# EAGLE design esp-rfid-relay-board (EAGLE 7.7.0)
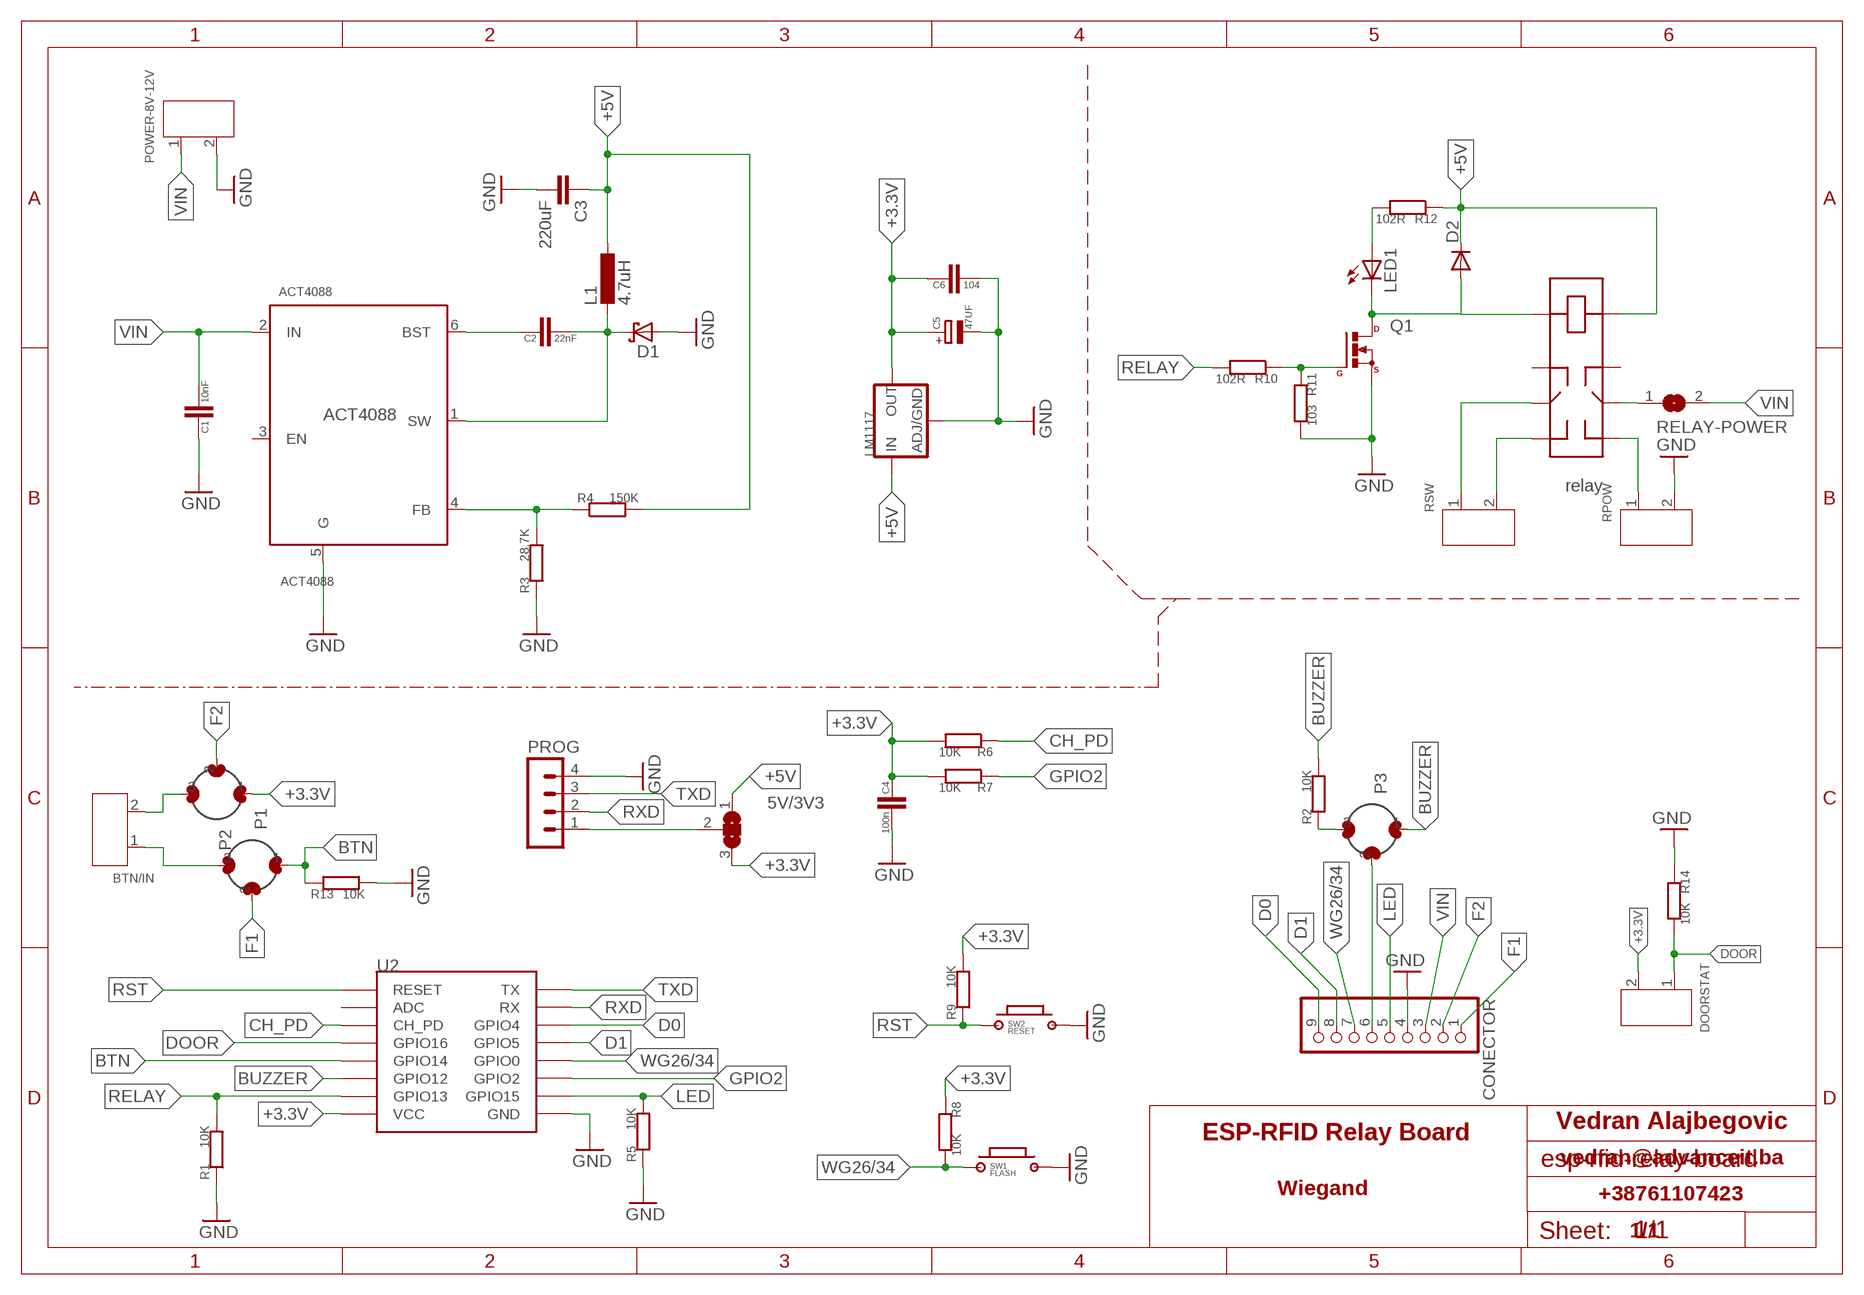
[diagram p0: schematic, sheet 1]

## Parts
5V/3V3  SJ2W  [SJ_2]
ACT4088  ACT4088  ACT4088-(SOT23-6)  [SOT-23-6]
BTN/IN  SCREW-TERMINAL-GREEN(2P-3.5)  [H2-3.5-7.0X7.0MM]
C1  10nF  CAPC0805  [C_0805]
C2  22nF  CAPC0805  [C_0805]
C3  220uF  C-EUC1210  [C1210]
C4  100n  CAPC0805  [C_0805]
C5  47UF  CPOLB_3528  [CPOL_B3528]
C6  104  CAPC0805  [C_0805]
CONECTOR  PINHD-1X9  [1X09]
D1  SCHOTTKY-DIODESMD  [SMB]
D2  4007-4148  DIODESOD123FL  [DIO_SOD123FL]
DOORSTAT  SCREW-TERMINAL-GREEN(2P-3.5)  [H2-3.5-7.0X7.0MM]
L1  4.7uH  L-EUL3225M  [L3225M]
LED1  LED0805LED  [0805LED]
LM1117  POWERSOT223  [SOT223]
P1  SJ3  [SJ_3]
P2  SJ3  [SJ_3]
P3  SJ3  [SJ_3]
POWER-8V-12V  SCREW-TERMINAL-GREEN(2P-3.5)  [H2-3.5-7.0X7.0MM]
PROG  MA04-1  [MA04-1]
Q1  MOSFET_NSOT23  [SOT23]
R1  10K  RESISTORR0805  [R_0805]
R2  10K  RESISTORR0805  [R_0805]
R3  28.7K  RESISTORR0805  [R_0805]
R4  150K  RESISTORR0805  [R_0805]
R5  10K  RESISTORR0805  [R_0805]
R6  10K  RESISTORR0805  [R_0805]
R7  10K  RESISTORR0805  [R_0805]
R8  10K  RESISTORR0805  [R_0805]
R9  10K  RESISTORR0805  [R_0805]
R10  102R  RESISTORR0805  [R_0805]
R11  103  RESISTORR0805  [R_0805]
R12  102R  RESISTORR0805  [R_0805]
R13  10K  RESISTORR0805  [R_0805]
R14  10K  RESISTORR0805  [R_0805]
RELAY  2XSWITCH  [HFD3-SIGNAL]
RELAY-POWER  SJ  [SJ]
RPOW  SCREW-TERMINAL-GREEN(2P-3.5)  [H2-3.5-7.0X7.0MM]
RSW  SCREW-TERMINAL-GREEN(2P-3.5)  [H2-3.5-7.0X7.0MM]
SW1  FLASH  BUTTON-2PSWITCH-TURTLE-2P  [2P-SWITCH-TURTLE]
SW2  RESET  BUTTON-2PSWITCH-TURTLE-2P  [2P-SWITCH-TURTLE]
U2  ESP12SMD  [ESP12-SMD]

## Nets
+3.3V: 5V/3V3.3 C4.1 C5.+ C6.1 DOORSTAT.2 LM1117.OUT1(OUT) LM1117.OUT2(OUT) P2.1 R6.2 R7.2 R8.1 R9.2 U2.VCC
+5V [VCC]: 5V/3V3.1 C3.1 D2.C L1.1 LM1117.IN+(IN) R4.2 R12.1 RELAY.8
BTN: P1.1 R13.1 U2.GPIO14
BUCK1: ACT4088.1(SW) C2.2 D1.C L1.2
BUCK2: ACT4088.4(FB) R3.2 R4.1
BUCK3: ACT4088.6(BST) C2.1
BUZZER: P3.1 R2.2 U2.GPIO12
CH_PD: R6.1 U2.CH_PD
D0: CONECTOR.9 U2.GPIO4
D1: CONECTOR.8 U2.GPIO5
DOOR: DOORSTAT.1 R14.2 U2.GPIO16
F1: CONECTOR.1 P1.2
F2: CONECTOR.2 P2.2
GND: ACT4088.5(G) C1.1 C3.2 C4.2 C5.- C6.2 CONECTOR.4 D1.A LM1117.GND POWER-8V-12V.2 PROG.4 Q1.2(S) R1.1 R3.1 R5.1 R11.2 R13.2 R14.1 RPOW.2 SW1.2 SW2.2 U2.GND
GPIO2: R7.1 U2.GPIO2
LED: CONECTOR.5 R5.2 U2.GPIO15
N$2: 5V/3V3.2 PROG.1
N$3: RELAY-POWER.1 RELAY.6
N$4: RELAY.5 RPOW.1
N$5: RELAY.4 RSW.2
N$6: BTN/IN.1 P1.3
N$7: BTN/IN.2 P2.3
N$8: RELAY.3 RSW.1
N$9: CONECTOR.6 P3.2
N$10: P3.3 R2.1
RELAY: R1.2 R10.2 U2.GPIO13
RELN1: Q1.1(G) R10.1 R11.1
RELN2 [ANT]: D2.A LED1.C Q1.3(D) RELAY.1
RELN4: LED1.A R12.2
RST: R9.1 SW2.1 U2.RESET
RXD: PROG.2 U2.RXD0(RX)
TXD: PROG.3 U2.TXD0(TX)
VIN: ACT4088.2(IN) C1.2 CONECTOR.3 POWER-8V-12V.1 RELAY-POWER.2
WG26/34: CONECTOR.7 R8.2 SW1.1 U2.GPIO0
Unconnected: ACT4088.3(EN) RELAY.2 RELAY.7 U2.ADC

## Notes on the sheet
- relay
- Vedran Alajbegovic
- ESP-RFID Relay Board
- vedran@advanceit.ba
- Wiegand | +38761107423
- 1/1

## Library data of the parts
5V/3V3 = jumper:SJ2W: SMD solder JUMPER
ACT4088 = Seeed-IC-2016:ACT4088-(SOT23-6): 310030104; MPN: AIC1896CG; VALUE: AIC1896CG-SOT23-6
BTN/IN DOORSTAT POWER-8V-12V RPOW RSW = Seeed-Connector -2016:SCREW-TERMINAL-GREEN(2P-3.5): 320110028; VALUE: GREEN-2P-3.5
C1 C2 C4 C6 = PRT-RCL:CAP
C3 = resistor:C-EU: CAPACITOR, European symbol
C5 = PRT-RCL:CPOL
CONECTOR = pinhead:PINHD-1X9: PIN HEADER
D1 = diode:SCHOTTKY-DIODE: Schottky Diode
D2 = PRT-RCL:DIODE: 1N4148;
L1 = rcl:L-EU: INDUCTOR, European symbol
LED1 = PRT-LEDs:LED
LM1117 = IC-Power:POWER: Voltage Regulator LM1117 Standard adjustable voltage regulator but in SMD form. Spark Fun Electronics SKU : COM-00595
P1-P3 = jumper:SJ3: SMD solder JUMPER
PROG = con-lstb:MA04-1: PIN HEADER; OC_FARNELL: unknown; OC_NEWARK: unknown
Q1 = PRT-RCL:MOSFET_N: Power MOSFET N-Channel
R1-R14 = PRT-RCL:RESISTOR
RELAY = PRT-Relay:2XSWITCH
RELAY-POWER = jumper:SJ: SMD solder JUMPER
SW1 SW2 = PRT-Switch:BUTTON-2P
U2 = esp8266modules:ESP12: ESP8266 Wifi module 12

## Net classes
0 default: clearance 0.205 mm
1 VCC: width 0.457 mm, clearance 0.254 mm
2 ANT: width 0.66 mm, clearance 0.152 mm

## Board
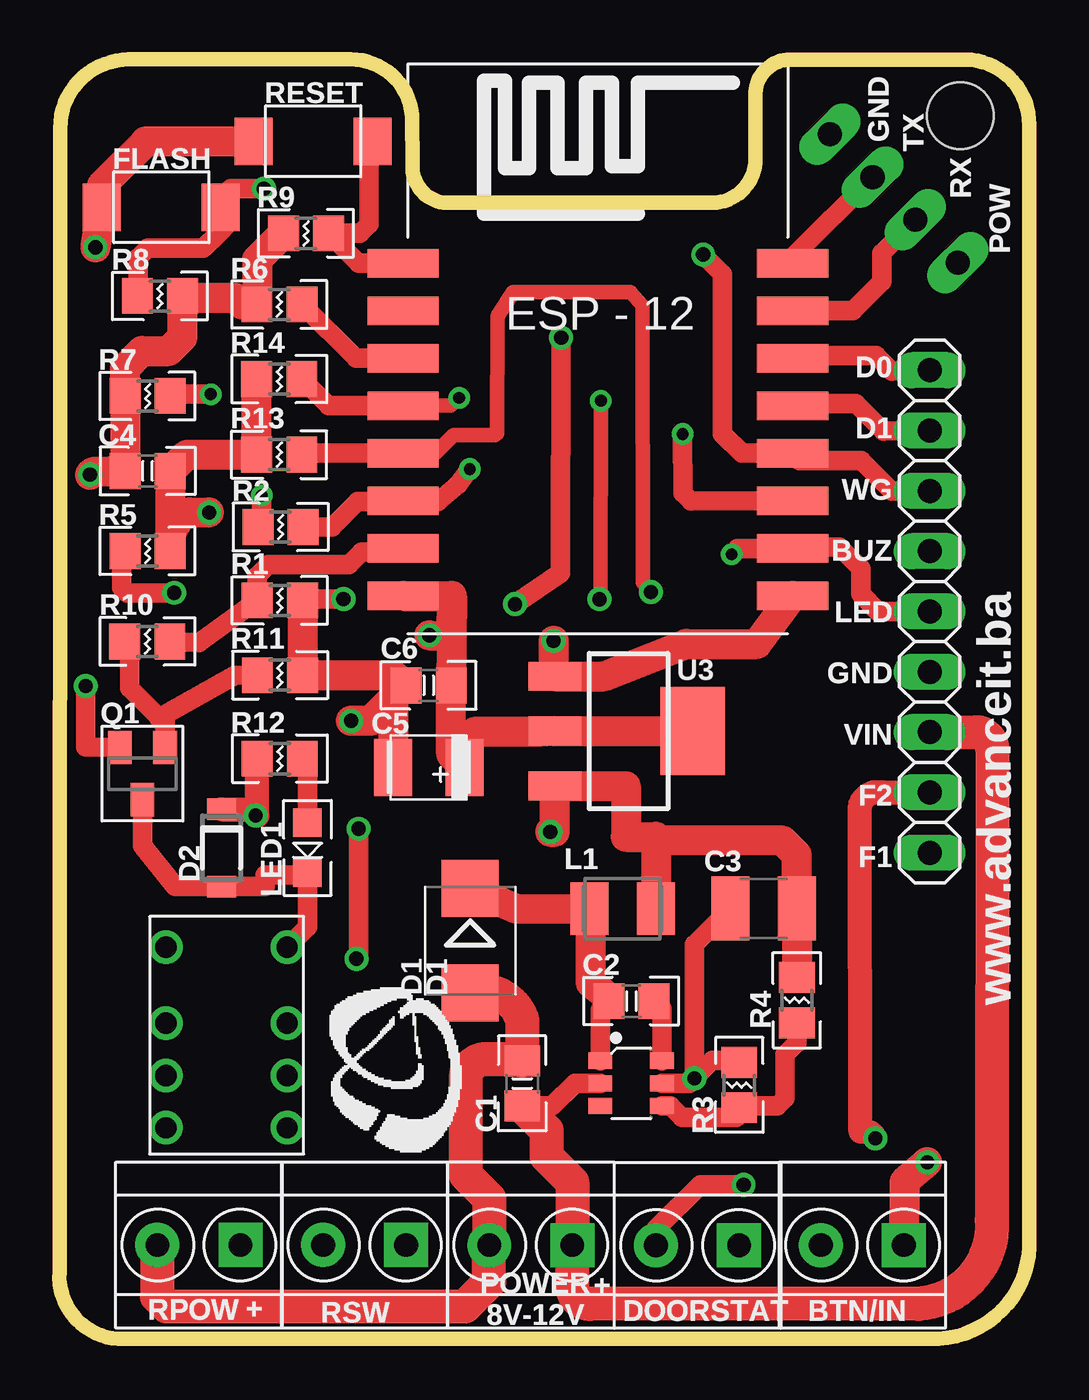
[diagram p1: board, top side]
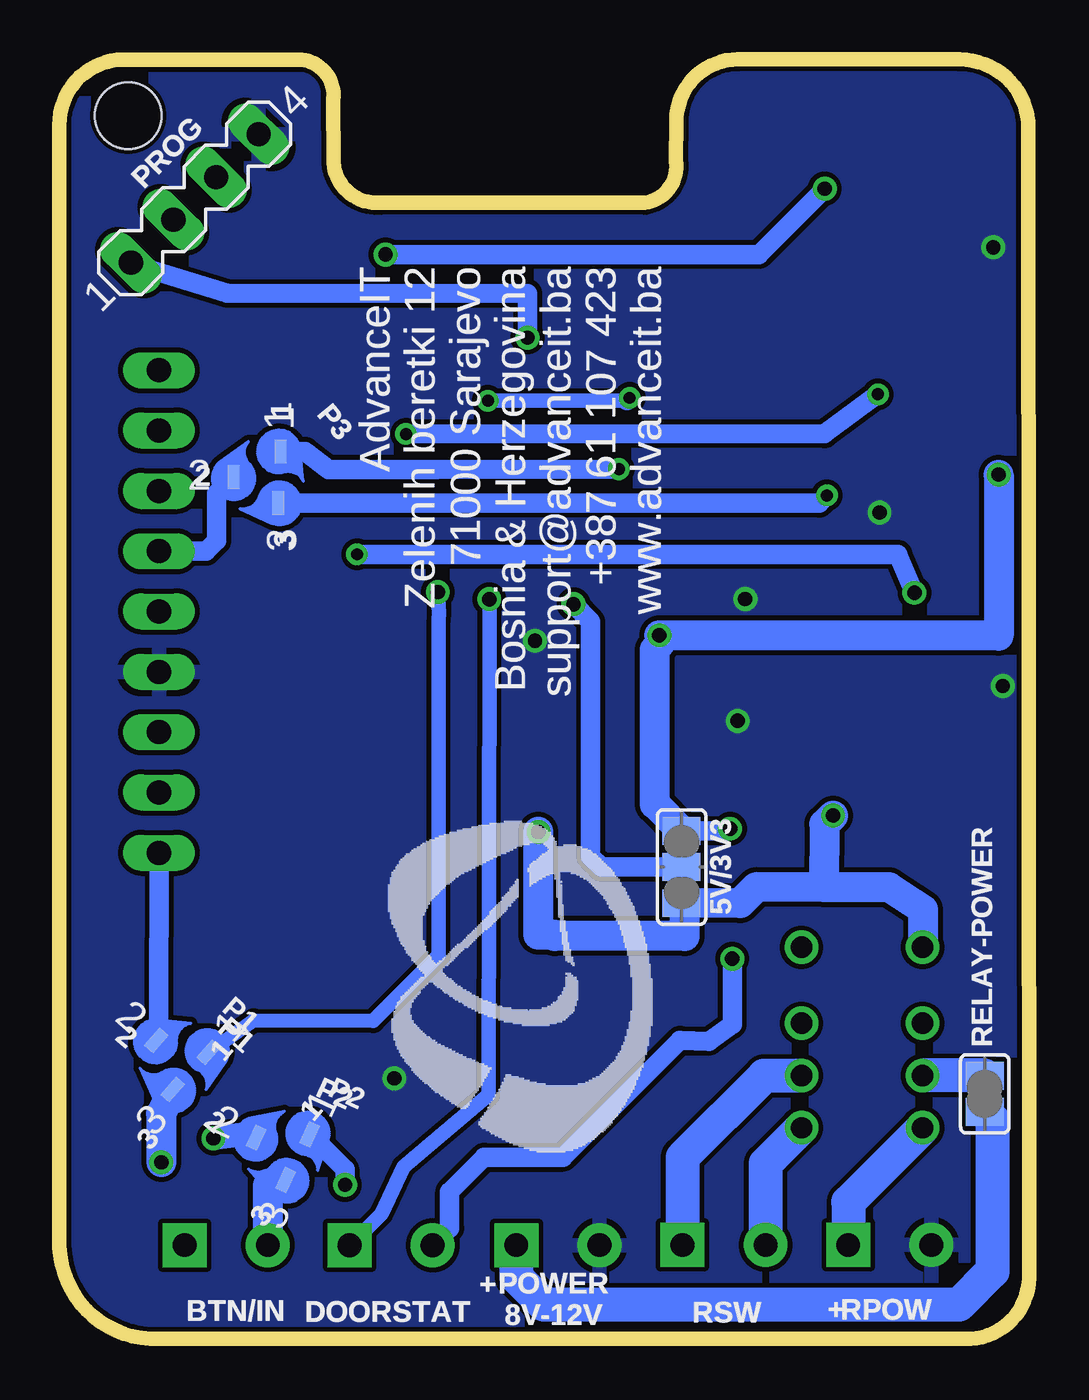
[diagram p2: board, bottom side, seen from below]

Size 40.85 x 53.88 mm. Coordinates in mm from the lower left corner, seen from the top.
Outline: 40.85,51.12 40.85,4.26 arc-90 37.04,0 2.47,0 arc-90 0.01,2.81 0.04,50.99 arc-90 2.93,53.88 12.27,53.88 arc-90 14.86,51.29 14.89,49.6 arc90 16.18,47.85 27.35,47.85 arc90 29.31,49.54 29.32,52.21 arc-90 30.65,53.87 38.16,53.87 arc-90 40.85,51.12
Copper layers (1*16): Top 0.035mm / dielectric 1.5mm / Bottom 0.035mm
Design rules "default *": minimum track width 6mil, minimum drill 12mil, track to track 6mil, track to pad 6mil, pad to pad 6mil, via to via 6mil, smd to smd 6mil, copper to edge 8mil, drill to drill 6mil, minimum pad ring 10mil, minimum via ring 8mil, stop-mask expansion 4mil, vias tented up to drill 10mil, thermal gap 10mil
Holes 2.8 mm at 37.95,51.5

### Footprints (pad centres in the part's own frame; a part is rotated, then mirrored left to right if it is on the bottom)
SJ_2 = smd 1.168 x 1.6: 1 -1.524,0; 2 0,0; 3 1.524,0
SOT-23-6 = smd 0.69 x 1: 1 -0.95,-1.3; 2 0,-1.3; 3 0.95,-1.3; 4 0.95,1.3; 5 0,1.3; 6 -0.95,1.3
H2-3.5-7.0X7.0MM = drill 1 pad 1.85 square: 1 -1.75,0 | drill 1 pad 1.85: 2 1.75,0
C_0805 = smd 1.3 x 1.5: 1 -0.95,0; 2 0.95,0
C1210 = smd 1.6 x 2.7: 1 -1.4,0; 2 1.4,0
CPOL_B3528 = smd 1.6 x 2.4: + -1.5,0; - 1.5,0
1X09 = drill 1.016 long: 1 -10.16,0; 2 -7.62,0; 3 -5.08,0; 4 -2.54,0; 5 0,0; 6 2.54,0; 7 5.08,0; 8 7.62,0; 9 10.16,0
SMB = smd 2.4 x 2.4: A 2.2,0; C -2.2,0
DIO_SOD123FL = smd 0.91 x 1.22: A 1.625,0; C -1.625,0
L3225M = smd 1.6 x 2.2: 1 -1.4,0; 2 1.4,0
0805LED = smd 1.2 x 1.2: A 1.05,0.1; C -1.05,0.1
SOT223 = smd 1.219 x 2.235: GND -2.311,-3.099; IN+ 2.311,-3.099; OUT1 0,-3.099 | smd 3.7 x 2.7: OUT2 0,2.7
SJ_3 = smd 1.016 x 0.508: 1 -1.114,0.72; 2 -0.04,-1.27; 3 1.064,0.61
MA04-1 = drill 1.016 long: 1 -3.81,0; 2 -1.27,0; 3 1.27,0; 4 3.81,0
SOT23 = smd 1 x 1.4: 1 -0.95,-1.1; 2 0.95,-1.1; 3 0,1.1
R_0805 = smd 1.3 x 1.5: 1 -0.95,0; 2 0.95,0
HFD3-SIGNAL = drill 0.9: 1 1.3,5.8; 2 4.5,5.8; 3 6.7,5.8; 4 8.9,5.8; 5 8.9,0.7; 6 6.7,0.7; 7 4.5,0.7; 8 1.3,0.7
SJ = smd 1.168 x 1.6: 1 -0.762,0; 2 0.762,0
2P-SWITCH-TURTLE = smd 1.6 x 2: 1 -0.5,-1.5; 2 4.5,-1.5
ESP12-SMD = smd 3 x 1.2: ADC -8.3,3.8; CH_PD -8.3,1.8; GND 8.1,-8.2; GPIO0 8.1,-2.2; GPIO2 8.1,-4.2; GPIO4 8.1,1.8; GPIO5 8.1,-0.2; GPIO12 -8.3,-4.2; GPIO13 -8.3,-6.2; GPIO14 -8.3,-2.2; GPIO15 8.1,-6.2; GPIO16 -8.3,-0.2; RESET -8.3,5.8; RXD0 8.1,3.8; TXD0 8.1,5.8; VCC -8.3,-8.2

### Placement (x,y rotation side)
5V/3V3  14.64,19.87 90 bottom
ACT4088  24.08,10.76 270 top
BTN/IN  33.82,3.95 180 top
C1  19.49,10.76 270 top
C2  24.09,14.23 180 top
C3  29.67,18.13 180 top
C4  3.72,36.55 0 top
C5  15.56,24.07 180 top
C6  15.56,27.52 180 top
CONECTOR  36.66,30.63 90 top
D1  17.3,16.78 270 top
D2  6.83,20.67 270 top
DOORSTAT  26.88,3.94 180 top
L1  23.72,18.11 180 top
LED1  10.55,20.68 90 top
LM1117  23.97,25.59 270 top
P1  35.83,11.7 228.9 bottom
P2  31.42,7.91 245.3 bottom
P3  32.24,36.26 270 bottom
POWER-8V-12V  19.86,3.95 180 top
PROG  35.15,48.03 45.1 bottom
Q1  3.5,23.8 180 top
R1  9.29,31.1 180 top
R2  9.31,34.19 0 top
R3  28.63,10.69 270 top
R4  31.06,14.26 90 top
R5  3.72,33.18 180 top
R6  9.27,43.56 180 top
R7  3.72,39.71 180 top
R8  4.24,43.92 180 top
R9  10.39,46.56 180 top
R10  3.71,29.37 0 top
R11  9.29,27.95 0 top
R12  9.28,24.43 0 top
R13  9.26,37.24 180 top
R14  9.26,40.42 0 top
RELAY  3.79,17.79 270 top
RELAY-POWER  1.88,10.32 270 bottom
RPOW  5.88,3.95 180 top
RSW  12.86,3.95 180 top
SW1  6.29,46.15 180 top
SW2  12.69,48.93 180 top
U2  22.78,39.49 0 top

### Tracks (layer width: path | path; a pad name or v marks a point on that pad's centre or on a via)
+3.3V  (via drill 0.6)
  Top 0.61: v12.51,16.01 12.6,16.11
  Top 0.813: 12.6,16.11 v12.6,21.48 | v28.82,6.49 26.99,6.49 25.13,4.62 DOORSTAT.2
  Top 1.27: U2.VCC 16.53,31.29 | 16.53,31.29 C6.1 16.51,24.62 C5.+ 17.06,25.09 17.52,25.56 20.21,25.56 LM1117.OUT1 LM1117.OUT2 | R9.2 8.32,45.44 R6.2 7.68,43.56 7.4,43.84 5.27,43.84 R8.1 5.19,42.18 4.6,41.6 3.47,41.6 2.76,40.89 R7.2 C4.1 1.39,36.5 v1.29,36.4 | v15.58,29.63 16.53,29.61 16.53,31.29
  Bottom 0.61: v12.6,21.48 12.69,21.39 | P2.1 29.83,8.14
  Bottom 0.813: 12.69,21.39 5V/3V3.3 | 29.83,8.14 28.82,7.14 v28.82,6.49 | DOORSTAT.2 24.41,4.66 24.41,6.2 22.96,7.64 19.64,7.64 14.71,12.57 13.49,12.53 12.51,13.24 v12.51,16.01
  Bottom 1.27: 5V/3V3.3 15.77,22.52 15.77,29.02 15.48,29.39 v15.58,29.63 1.29,29.61 v1.29,36.4
+5V  (via drill 0.6)
  Top 1.016: R12.1 8.33,22.04 v8.26,22.04 8.26,22.3 D2.C
  Top 1.27: R4.2 31.07,15.45 C3.1 31.06,18.14 31.06,20.39 30.46,20.98 25.12,20.98 | 25.12,20.98 25.12,21.14 23.86,21.14 23.86,23.28 LM1117.IN+ 20.87,21.35 v20.68,21.35 | 25.12,20.98 L1.1
  Bottom 1.27: RELAY.8 4.46,16.96 4.46,18.07 5.91,19.02 8.64,19.02 | 8.64,19.02 11.5,19.03 12.18,18.35 5V/3V3.1 14.52,18.34 14.52,16.96 19.98,16.96 19.98,17.01 20.68,17.01 v20.68,21.35 | v8.26,22.04 8.63,21.67 8.64,19.02
BTN  (via drill 0.6)
  Top 0.61: U2.GPIO14 15.84,37.29 16.6,38.06 18.35,38.06 18.42,38.13 18.45,43.08 19.1,44.09 24.05,44.09 24.56,43.52 24.58,31.86 v24.91,31.45
  Top 0.813: R13.1 10.27,37.29 U2.GPIO14
  Bottom 0.61: P1.1 32.67,13.42 27.63,13.39 24.87,16.15 24.87,30.27 24.85,30.59 v24.91,31.45
BUCK1
  Top 0.813: C2.2 22.78,13.87 ACT4088.1
  Top 1.27: C2.2 23.14,14.35 22.37,15 22.37,18.23 L1.2 19.19,18.13 D1.C
BUCK2
  Top 0.813: ACT4088.4 25.73,9.81 26.21,9.33 28.51,9.33 R3.2 28.7,9.81 30.24,9.81 30.55,10.12 30.55,11.96 31.05,12.46 R4.1
BUCK3
  Top 0.813: C2.1 25.38,13.89 ACT4088.6
BUZZER  (via drill 0.5)
  Top 0.813: R2.2 11.48,34.19 12.56,35.27 14.46,35.27 U2.GPIO12 14.5,35.31 15.95,35.27 16.79,35.98 v17.28,36.63
  Bottom 0.813: v17.28,36.63 24.96,36.6 29.51,36.6 30.5,37.37 P3.1
CH_PD
  Top 0.813: R6.1 12.49,41.29 U2.CH_PD
D0
  Top 0.813: U2.GPIO4 31,41.42 34.4,41.42 35.06,40.76 CONECTOR.9
D1
  Top 0.813: U2.GPIO5 30.97,39.38 33.54,39.38 34.7,38.22 CONECTOR.8
DOOR  (via drill 0.5, 0.6)
  Top 0.61: 14.49,39.3 16.47,39.3 16.8,39.63 | v22.8,39.51 22.79,31.44 v22.74,31.15
  Top 0.813: R14.2 11.34,39.29 U2.GPIO16 14.49,39.3 | 16.8,39.63 v16.83,39.63
  Bottom 0.61: 16.95,39.51 v22.8,39.51 | DOORSTAT.1 27.29,5.26 26.36,7.25 22.78,10.28 22.73,29.85 v22.74,31.15
  Bottom 0.813: v16.83,39.63 16.95,39.51
F1
  Bottom 0.813: CONECTOR.1 36.66,13.34 P1.2
F2  (via drill 0.6)
  Top 1.016: v34.36,8.44 arc90 33.74,8.72 33.72,22.43 arc-90 34.66,23.01 CONECTOR.2
  Bottom 0.813: P2.2 arc-90 32.73,8.65
  Bottom 1.016: 32.73,8.65 v34.36,8.44
GND  (via drill 0.6)
  Top 0.813: ACT4088.5 26.54,10.77 v26.74,10.97 | C3.2 26.74,16.61 v26.74,10.97 | v1.11,27.49 1.11,24.92 2.16,24.9 Q1.2 | R5.1 4.55,33.17 5.18,34.38 5.47,34.81 | R1.1 10.3,31.16 v11.96,31.16 | v26.74,10.97 v26.75,10.97 27.5,11.72 28.84,11.72 R3.1
  Top 1.27: 14.06,26.97 C6.2 14.06,27.95 R11.2 R1.1 | 14.06,26.97 C5.- | SW2.2 8.18,50.42 3.63,50.42 1.79,48.57 SW1.2 1.75,47.39 v1.52,45.97 | R14.1 R13.2 5.36,37.24 C4.2 R5.1 | U2.GND 29.39,29.26 26.39,29.27 22.91,27.9 LM1117.GND 20.81,27.96 v20.81,29.4 | 5.47,34.81 v6.3,34.8 | 14.06,26.97 13.12,26.03 v12.28,26.03
  Top 1.422: RPOW.2 4.11,1.79 4.53,1.37 17.08,1.37 18.11,2.39 POWER-8V-12V.2 18.11,5.92 17.11,6.91 17.11,10.95 arc-90 17.94,11.78 19.42,11.78 arc-90 C1.1 19.49,13.43 arc90 D1.A
  pour Bottom: 41.57,52.99 41.02,54.55 -0.68,54.75 -0.72,-0.6 0.14,-0.85 41.38,-0.32 41.64,49.24
GPIO2  (via drill 0.5)
  Top 0.813: R7.1 4.74,39.78 v6.37,39.78 | v26.25,38.11 26.26,35.62 26.6,35.28 U2.GPIO2
  Bottom 0.813: v6.37,39.78 8.62,38.12 v26.25,38.11
LED  (via drill 0.5, 0.6)
  Top 0.813: R5.2 2.63,33.05 2.63,31.65 2.86,31.42 v4.84,31.42 | v28.31,33.04 28.57,33.29 U2.GPIO15 30.93,33.35 32.85,33.35 33.76,32.44 33.76,31.36 34.48,30.63 CONECTOR.5
  Bottom 0.406: 28.45,32.9 v28.31,33.04
  Bottom 0.813: v4.84,31.42 5.53,33.04 v28.31,33.04
N$2  (via drill 0.6)
  Top 0.813: v21.13,42.17 21.1,32.25 v19.19,30.94
  Bottom 0.813: PROG.1 37.84,45.28 33.78,44.03 21.13,44.02 v21.13,42.17 | v19.19,30.94 18.47,30.21 18.47,20.32 18.02,19.87 5V/3V3.2
N$3
  Bottom 1.422: RELAY-POWER.1 RELAY.6
N$4
  Bottom 1.422: RELAY.5 7.63,5.75 RPOW.1
N$5
  Bottom 1.422: RELAY.4 11.11,7.38 RSW.2
N$6  (via drill 0.6)
  Top 1.27: v36.56,7.43 35.59,6.61 BTN/IN.1
  Bottom 1.27: P1.3 36.56,9.48 v36.56,7.43
N$7
  Bottom 1.27: P2.3 32.07,6.45 BTN/IN.2
N$8
  Bottom 1.422: RELAY.3 11.16,11.08 14.61,7.64 RSW.1
N$9
  Bottom 0.813: P3.2 34.22,35.6 34.22,33.62 34.66,33.17 CONECTOR.6
N$10  (via drill 0.5)
  Top 0.813: R2.1 8.52,34.35 v8.52,35.52
  Bottom 0.813: v8.52,35.52 8.85,35.19 P3.3
RELAY
  Top 0.813: R10.2 5.89,29.33 R1.2 8.34,32.13 8.8,32.6 12.19,32.6 12.72,33.13 14.32,33.13 U2.GPIO13
RELN1
  Top 0.813: R11.1 7.37,27.94 4.45,26.3 4.45,25.8 | 4.45,25.8 Q1.1 | R10.1 2.95,29.17 2.95,27.42 4.12,26.25 4.45,25.8
RELN2
  Top 0.813: Q1.3 3.51,22.69 3.51,20.76 4.88,19.05 D2.A 8.66,19.05 8.66,19.53 9.88,19.53 LED1.C 10.45,17.34 RELAY.1
RELN4
  Top 0.813: R12.2 10.45,24.48 LED1.A
RST
  Top 0.813: SW2.1 13.05,50.3 13.05,46.95 12.66,46.55 R9.1 12.6,45.29 U2.RESET
RXD
  Top 0.813: PROG.2 34.64,45.73 34.64,44.52 33.42,43.29 U2.RXD0
TXD
  Top 0.813: PROG.3 30.88,45.55 U2.TXD0
VIN
  Top 0.813: ACT4088.2 21.71,10.77 20.75,9.81 C1.2
  Top 1.422: C1.2 20.52,8.78 20.52,7.68 21.61,6.6 POWER-8V-12V.1 21.61,2.2 arc90 22.33,1.48 36.18,1.48 arc90 39.27,4.99 39.29,24.85 arc90 38.59,25.55 36.67,25.54 arc-90 CONECTOR.3
  Bottom 1.422: RELAY-POWER.2 1.55,9.23 1.55,2.84 2.95,1.44 20.44,1.44 21.61,2.6 POWER-8V-12V.1
WG26/34  (via drill 0.6)
  Top 0.813: 30.54,37.29 U2.GPIO0 | R8.2 3.33,43.95 3.33,45.54 3.71,45.93 6.06,45.93 6.66,46.52 | 6.66,46.52 6.66,47.53 SW1.1 | U2.GPIO0 31.18,36.99 33.77,36.99 35.05,35.71 CONECTOR.7 | 6.66,46.52 7.15,47.02 7.15,48.38 7.21,48.43 v8.62,48.43 | v27.11,45.66 27.94,44.84 27.94,38.1 28.74,37.29 U2.GPIO0
  Bottom 0.813: v8.62,48.43 11.39,45.66 v27.11,45.66

### Text on the board
tPlace: GND | RESET | TX | RX | FLASH | POW | R9 | R8 | R6 | R14 | R7 | R13 | C4 | R2 | R5 | R1 | R10 | D0 / D1 / WG / BUZ / LED / GND / VIN / F2 / F1 | R11 | C6 | U3 | Q1 | R12 | C5 | www.advanceit.ba | L1 | C3 | D2 | LED1 | C2 | D1 | R4 | C1 | R3 | RPOW | RSW | POWER / 8V-12V | + | + | DOORSTAT | BTN/IN
bPlace: PROG | AdvanceIT / Zelenih beretki 12 / 71000 Sarajevo / Bosnia & Herzegovina / support@advanceit.ba / +387 61 107 423 / www.advanceit.ba | 1 | P3 | 2 | 3 | 5V/3V3 | P1 | 2 | RELAY-POWER | 1 | P2 | 1 | 2 | 3 | 3 | RPOW | RSW | POWER / 8V-12V | + | DOORSTAT | BTN/IN | +
tNames: GND | RESET | TX | RX | FLASH | POW | D0 / D1 / WG / BUZ / LED / GND / VIN / F2 / F1 | www.advanceit.ba | POWER / 8V-12V | +
bNames: AdvanceIT / Zelenih beretki 12 / 71000 Sarajevo / Bosnia & Herzegovina / support@advanceit.ba / +387 61 107 423 / www.advanceit.ba | RPOW | RSW | POWER / 8V-12V | + | DOORSTAT | BTN/IN | +
_tNames: GND | TX | RX | POW | R9 | R8 | R6 | R14 | R7 | R13 | C4 | R2 | R5 | R1 | R10 | D0 / D1 / WG / BUZ / LED / GND / VIN / F2 / F1 | R11 | C6 | Q1 | R12 | C5 | www.advanceit.ba | L1 | C3 | D2 | LED1 | C2 | D1 | R4 | C1 | R3 | RPOW | RSW | POWER / 8V-12V | + | + | DOORSTAT | BTN/IN
_bNames: PROG | AdvanceIT / Zelenih beretki 12 / 71000 Sarajevo / Bosnia & Herzegovina / support@advanceit.ba / +387 61 107 423 / www.advanceit.ba | 1 | P3 | 2 | 3 | 5V/3V3 | RELAY-POWER | P1 | 2 | 1 | P2 | 1 | 2 | 3 | 3 | RPOW | RSW | POWER / 8V-12V | + | DOORSTAT | BTN/IN | +